# EasyEDA Pro project ProPrj_FurModularity 2_2025-12-27.epro, board PCB2_5
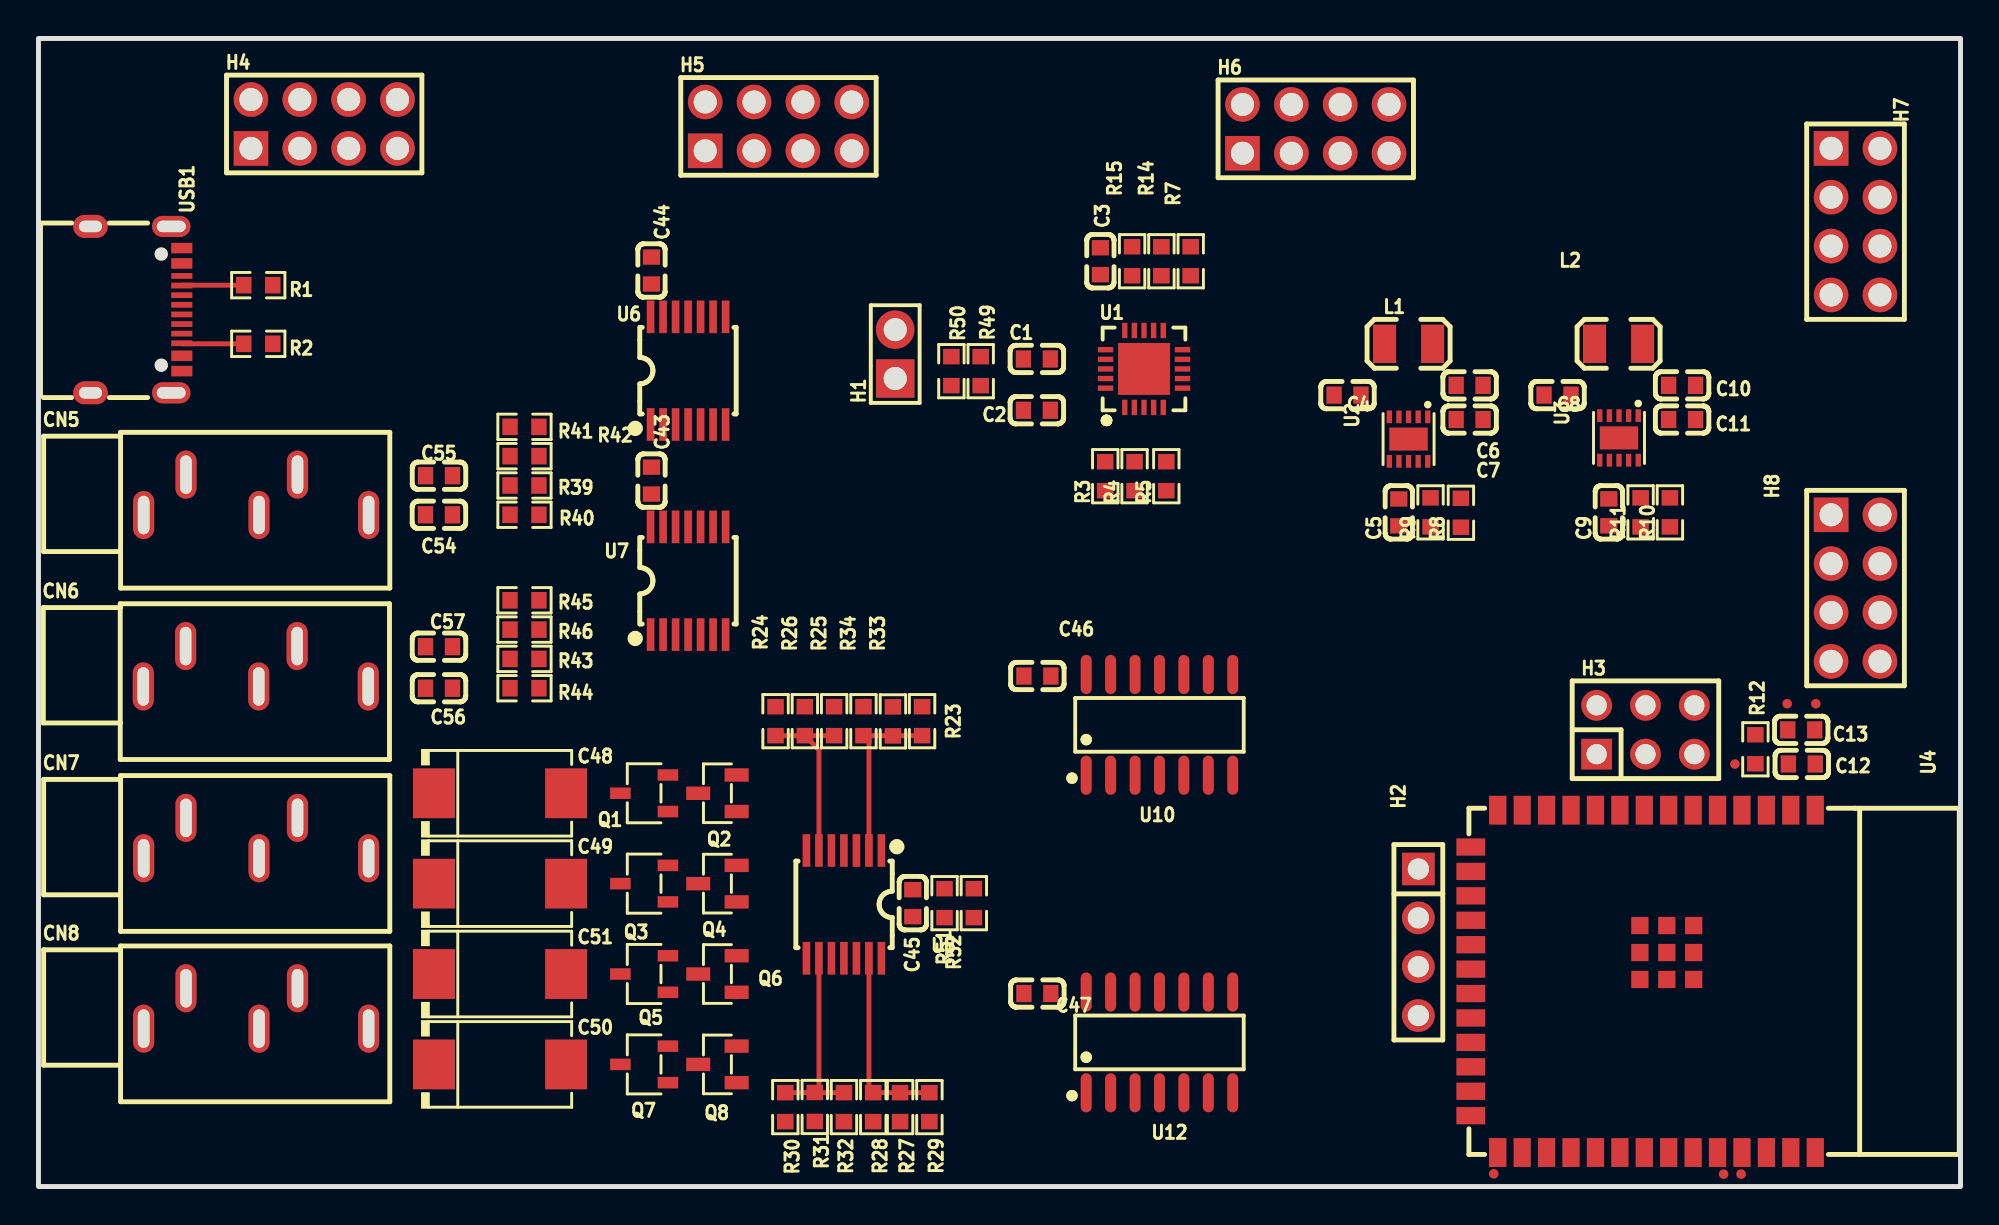
[diagram p9: board, top side]
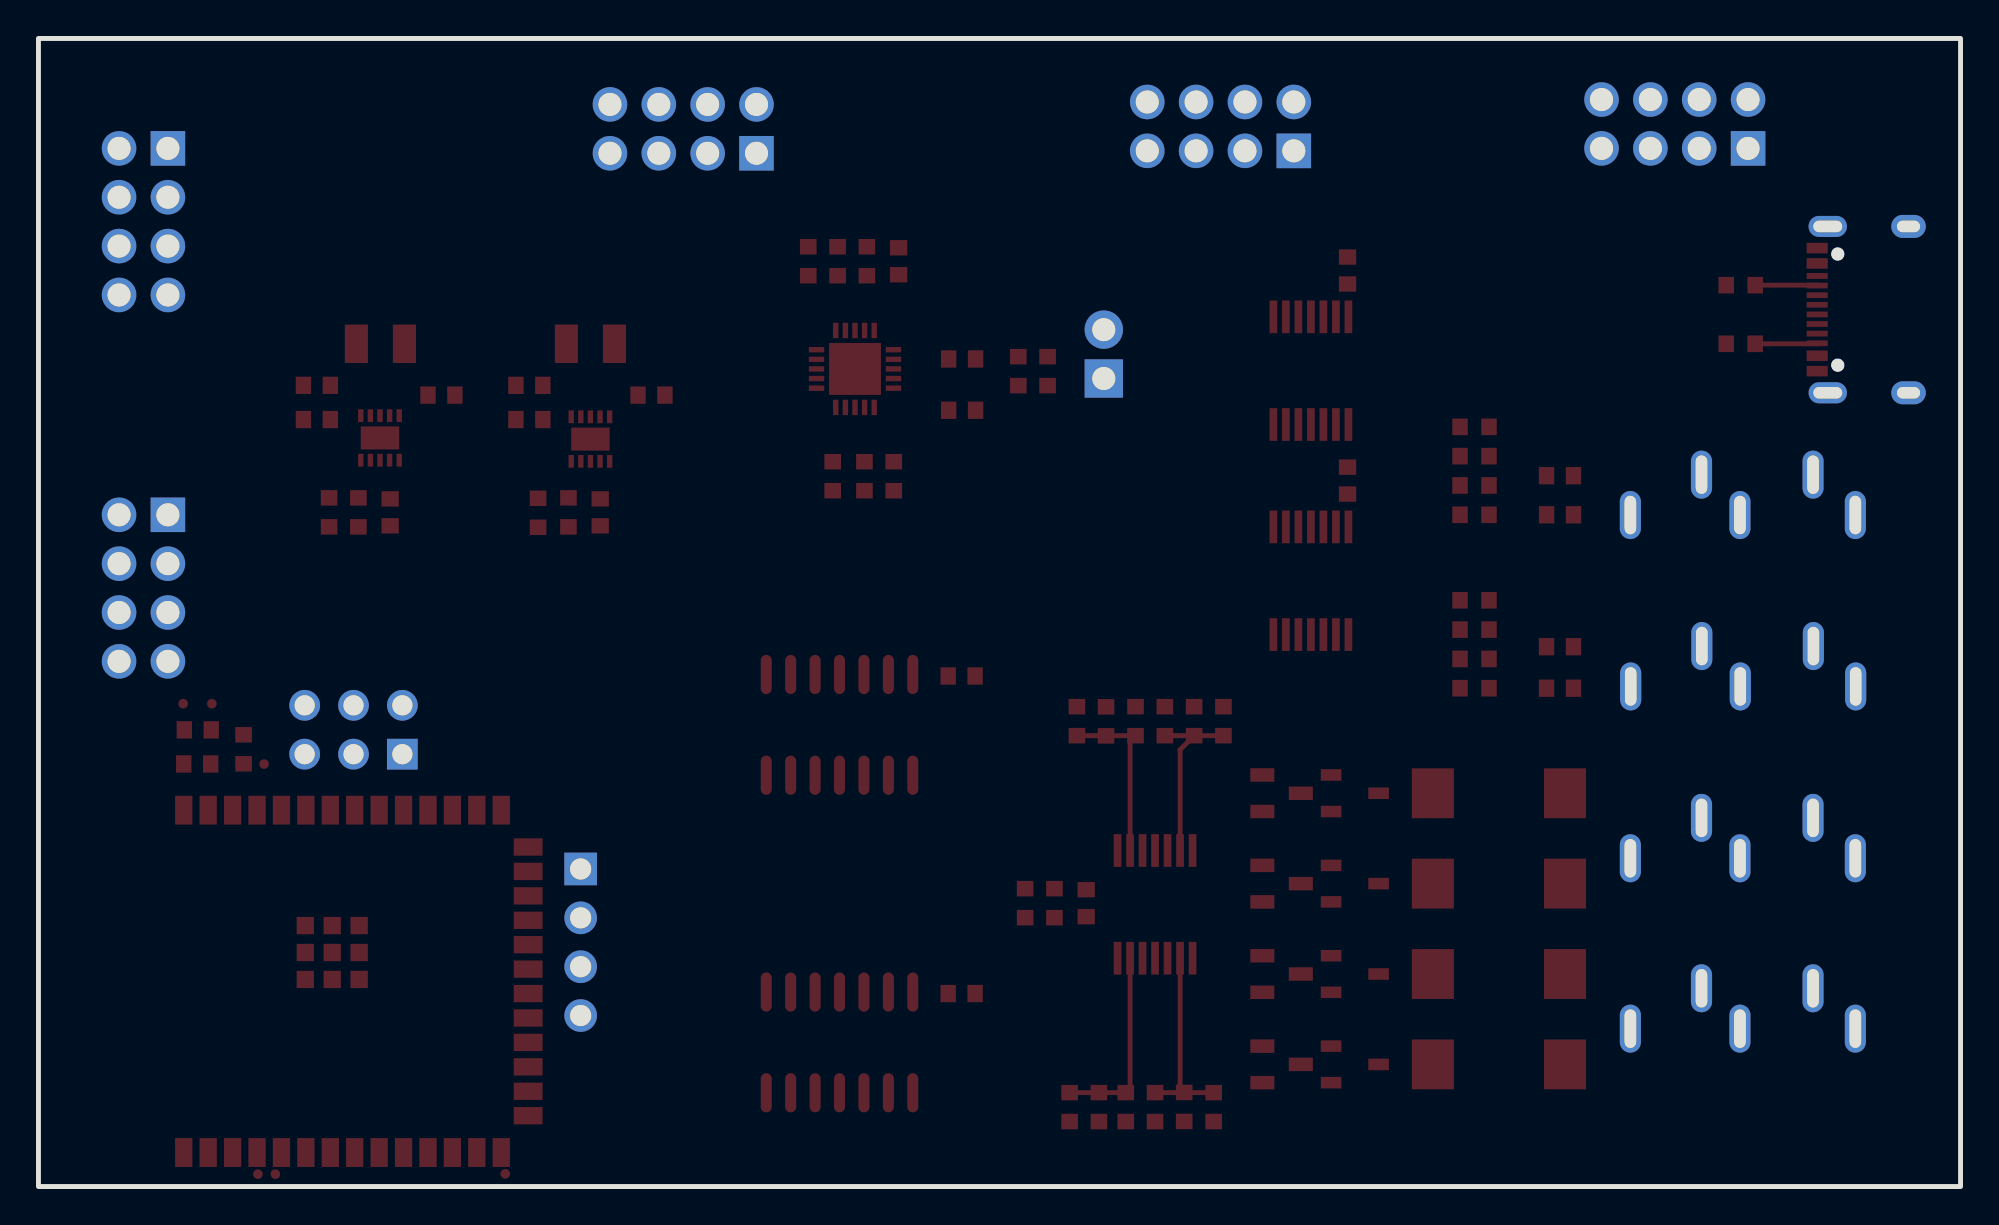
[diagram p10: board, bottom side, seen from below]

Outline 99.95 x 59.69 mm; copper layers: Top Layer, Inner1, Inner2, Bottom Layer. Coordinates in mm from the lower left corner of the outline.
Outline path: rectangle 0,59.69 99.95,0
Stack: Top Layer 0.035mm Outer layer thickness 1oz / Dielectric1 0.2104mm 7628 RC49% 8.6mil / Inner1 0.0152mm Inner layer thickness / Dielectric2 1.065mm 1.1mm H/HOZ Copper / Inner2 0.0152mm Inner layer thickness / Dielectric3 0.2104mm 7628 RC49% 8.6mil / Bottom Layer 0.035mm Outer layer thickness 1oz

## Design rules (mm)
template: JLCPCB Capability(Two Layers Board)
spacing copperThickness1oz (default): track to track 0.102, other pairs 0.152 to 0.3
spacing copperThickness2oz: track to track 0.203, other pairs 0.152 to 0.3
track width copperThickness1oz (default): min 0.127, default 0.254, max 2.54
track width copperThickness2oz: min 0.203, default 0.254, max 2.54
differential pair differentialPair (default): width min 0.127, default 0.254, max 2.54; gap min 0.152, default 0.152
via viaSize (default): diameter min 0.5, default 0.61, max 10; hole min 0.3, default 0.305, max 6.3

## Placement (name value [footprint] x y rotation side)
C1  10uF  [C0603]  51.92 43.03 0 top
C2  4.7uF  [C0603]  51.92 40.36 180 top
C3  4.7uF  [C0603]  55.22 48.11 90 top
C4  10uF  [C0603]  68.07 41.15 180 top
C5  100nF  [C0603]  70.74 35.05 270 top
C6  10uF  [C0603]  74.42 41.66 0 top
C7  10uF  [C0603]  74.42 39.88 0 top
C8  10uF  [C0603]  78.99 41.15 180 top
C9  100nF  [C0603]  81.66 35.05 270 top
C10  10uF  [C0603]  85.47 41.66 0 top
C11  10uF  [C0603]  85.47 39.88 0 top
C12  100nF  [C0603]  91.69 21.97 0 top
C13  100nF  [C0603]  91.66 23.74 0 top
C43  100nF  [C0603]  31.88 36.7 270 top
C44  100nF  [C0603]  31.88 47.62 270 top
C45  100nF  [C0603]  45.47 14.73 90 top
C46  10uF  [C0603]  51.94 26.54 180 top
C47  10uF  [C0603]  51.94 10.03 180 top
C48  470uF  [CAP-SMD_L7.3-W4.3-FD]  24 20.45 0 top
C49  470uF  [CAP-SMD_L7.3-W4.3-FD]  24 15.75 0 top
C50  470uF  [CAP-SMD_L7.3-W4.3-FD]  24 6.35 0 top
C51  470uF  [CAP-SMD_L7.3-W4.3-FD]  24 11.05 0 top
C54  10uF  [C0603]  20.83 34.93 180 top
C55  10uF  [C0603]  20.83 36.96 180 top
C56  10uF  [C0603]  20.83 25.91 180 top
C57  10uF  [C0603]  20.83 28.07 180 top
CN5  KH-PJ-325C  [AUDIO-TH_KH-PJ-325C]  11.32 35.96 0 top
CN6  KH-PJ-325C  [AUDIO-TH_KH-PJ-325C]  11.3 27.05 0 top
CN7  KH-PJ-325C  [AUDIO-TH_KH-PJ-325C]  11.32 18.12 0 top
CN8  KH-PJ-325C  [AUDIO-TH_KH-PJ-325C]  11.32 9.26 0 top
H1  PZ254V-11-02P  [HDR-TH_2P-P2.54-V-M]  44.55 43.28 90 top
H2  PZ254V-11-04P  [HDR-TH_4P-P2.54-V-M]  71.75 12.7 270 top
H3  2.54-2*3  [HDR-TH_6P-P2.54-V-R2-C3-S2.54_A2541WV-2X3P]  83.57 23.75 0 top
H4  A2541WV-2x4P  [HDR-TH_8P-P2.54-V-R2-C4-S2.54_A2541WV-2X4P]  14.86 55.25 0 top
H5  A2541WV-2x4P  [HDR-TH_8P-P2.54-V-R2-C4-S2.54_A2541WV-2X4P]  38.48 55.12 0 top
H6  A2541WV-2x4P  [HDR-TH_8P-P2.54-V-R2-C4-S2.54_A2541WV-2X4P]  66.42 54.99 0 top
H7  A2541WV-2x4P  [HDR-TH_8P-P2.54-V-R2-C4-S2.54_A2541WV-2X4P]  94.49 50.17 270 top
H8  A2541WV-2x4P  [HDR-TH_8P-P2.54-V-R2-C4-S2.54_A2541WV-2X4P]  94.49 31.12 270 top
L1  1.5uH  [L1207]  71.25 43.82 0 top
L2  1.5uH  [L1207]  82.17 43.81 0 top
Q1  MMBT2222A  [SOT-23-3_L2.9-W1.6-P1.90-LS2.8-BR]  31.5 20.45 0 top
Q2  MMBT2907A  [SOT-23-3_L2.9-W1.3-P1.90-LS2.4-BR]  35.31 20.45 0 top
Q3  MMBT2222A  [SOT-23-3_L2.9-W1.6-P1.90-LS2.8-BR]  31.5 15.75 0 top
Q4  MMBT2907A  [SOT-23-3_L2.9-W1.3-P1.90-LS2.4-BR]  35.31 15.75 0 top
Q5  MMBT2222A  [SOT-23-3_L2.9-W1.6-P1.90-LS2.8-BR]  31.5 11.05 0 top
Q6  MMBT2907A  [SOT-23-3_L2.9-W1.3-P1.90-LS2.4-BR]  35.31 11.05 0 top
Q7  MMBT2222A  [SOT-23-3_L2.9-W1.6-P1.90-LS2.8-BR]  31.5 6.35 0 top
Q8  MMBT2907A  [SOT-23-3_L2.9-W1.3-P1.90-LS2.4-BR]  35.31 6.35 0 top
R1  5.1kΩ  [R0603]  11.43 46.86 180 top
R2  5.1kΩ  [R0603]  11.43 43.82 180 top
R3  330kΩ  [R0603]  55.47 36.93 270 top
R4  110kΩ  [R0603]  57 36.93 90 top
R5  10kΩ  [R0603]  58.65 36.93 90 top
R7  100kΩ  [R0603]  59.92 48.11 270 top
R8  1.13MΩ  [R0603]  73.97 35.03 270 top
R9  200kΩ  [R0603]  72.39 35.05 90 top
R10  1.8MΩ  [R0603]  84.84 35.05 270 top
R11  200kΩ  [R0603]  83.31 35.05 90 top
R12  10kΩ  [R0603]  89.28 22.73 90 top
R14  1kΩ  [R0603]  58.39 48.11 270 top
R15  1kΩ  [R0603]  56.87 48.11 270 top
R23  1kΩ  [R0603]  45.95 24.19 90 top
R24  1kΩ  [R0603]  38.33 24.19 90 top
R25  1kΩ  [R0603]  41.38 24.19 270 top
R26  1kΩ  [R0603]  39.85 24.19 270 top
R27  1kΩ  [R0603]  44.81 4.13 90 top
R28  1kΩ  [R0603]  43.41 4.13 90 top
R29  1kΩ  [R0603]  46.33 4.13 270 top
R30  1kΩ  [R0603]  38.84 4.13 270 top
R31  1kΩ  [R0603]  40.37 4.14 90 top
R32  1kΩ  [R0603]  41.88 4.13 90 top
R33  1kΩ  [R0603]  44.43 24.19 270 top
R34  1kΩ  [R0603]  42.9 24.19 270 top
R39  10kΩ  [R0603]  25.27 36.45 0 top
R40  10kΩ  [R0603]  25.27 34.93 180 top
R41  10kΩ  [R0603]  25.27 39.5 0 top
R42  10kΩ  [R0603]  25.27 37.97 180 top
R43  10kΩ  [R0603]  25.27 27.43 0 top
R44  10kΩ  [R0603]  25.27 25.91 180 top
R45  10kΩ  [R0603]  25.27 30.48 0 top
R46  10kΩ  [R0603]  25.27 28.96 180 top
R49  1kΩ  [R0603]  49 42.39 90 top
R50  1kΩ  [R0603]  47.47 42.39 270 top
R51  1kΩ  [R0603]  47.12 14.73 90 top
R52  1kΩ  [R0603]  48.64 14.73 270 top
TP1  -  [Test-Point-0.5mm]  88.22 21.97 0 top
TP2  -  [Test-Point-0.5mm]  75.68 0.66 0 top
TP3  -  [Test-Point-0.5mm]  88.54 0.65 0 top
TP4  -  [Test-Point-0.5mm]  87.63 0.65 0 top
TP5  -  [Test-Point-0.5mm]  90.93 25.1 0 top
TP6  -  [Test-Point-0.5mm]  92.43 25.1 0 top
U1  MCP73871-2CAI/ML  [QFN-20_L4.0-W4.0-P0.50-BL-EP2.7]  57.49 42.51 0 top
U2  TPS63030DSKTG4  [SON-10_L2.5-W2.5-P0.50-TL-EP]  71.25 38.86 270 top
U3  TPS63030DSKTG4  [SON-10_L2.5-W2.5-P0.50-TL-EP]  82.19 38.92 270 top
U4  ESP32-S3-WROOM-1-N4  [WIFIM-SMD_ESP32-S3-WROOM-1-N8]  83.44 10.67 270 top
U6  MCP4261-103E/ST  [TSSOP-14_L5.0-W4.4-P0.65-LS6.4-BL]  33.78 42.42 0 top
U7  MCP4261-103E/ST  [TSSOP-14_L5.0-W4.4-P0.65-LS6.4-BL]  33.78 31.5 0 top
U8  LMV324IPWRE4  [TSSOP-14_L5.0-W4.4-P0.65-LS6.4-BL]  41.88 14.67 180 top
U10  74VHC4066M  [SOIC-14_L8.7-W3.9-P1.27-LS6.0-BL]  58.29 24 0 top
U12  74VHC4066M  [SOIC-14_L8.7-W3.9-P1.27-LS6.0-BL]  58.29 7.49 0 top
USB1  TYPE-C 16PIN 2MD(073)  [USB-C-SMD_TYPE-C-6PIN-2MD-073]  5.08 45.59 270 top

## Footprints (pads in the part's own frame, mm; a bottom-side part is the same pattern mirrored in y, then rotated)
AUDIO-TH_KH-PJ-325C
  oval 1.1x2.5 hole 0.6x2: 1(-5.85,-1.05) 2(0.15,-1.05) 3(2.15,1.05) 4(5.85,-1.05) 5(-3.65,1.05)
C0603
  rect 0.8x0.9 smd: 1(-0.7,0) 2(0.7,0)
CAP-SMD_L7.3-W4.3-FD
  rect 2.185x2.592 smd: 1(-3.437,0) 2(3.437,0)
HDR-TH_2P-P2.54-V-M
  rect 2x2 hole 1.2: 1(-1.27,0)
  round 2 hole 1.2: 2(1.27,0)
HDR-TH_4P-P2.54-V-M
  rect 1.7x1.7 hole 1.1: 1(-3.81,0)
  round 1.7 hole 1.1: 2(-1.27,0) 3(1.27,0) 4(3.81,0)
HDR-TH_6P-P2.54-V-R2-C3-S2.54_A2541WV-2X3P
  rect 1.6x1.6 hole 1.05: 1(-2.54,-1.27)
  round 1.6 hole 1.05: 2(-2.54,1.27) 3(0,-1.27) 4(0,1.27) 5(2.54,-1.27) 6(2.54,1.27)
HDR-TH_8P-P2.54-V-R2-C4-S2.54_A2541WV-2X4P
  rect 1.8x1.8 hole 1.2: 1(-3.81,-1.27)
  round 1.8 hole 1.2: 2(-3.81,1.27) 3(-1.27,-1.27) 4(-1.27,1.27) 5(1.27,-1.27) 6(1.27,1.27) 7(3.81,-1.27) 8(3.81,1.27)
L1207
  rect 1.2x2 smd: 1(-1.25,0) 2(1.25,0)
QFN-20_L4.0-W4.0-P0.50-BL-EP2.7
  rect 0.28x0.8 smd: 1(-1,-2) 2(-0.5,-2) 3(0,-2) 4(0.5,-2) 5(1,-2) 11(1,2) 12(0.5,2) 13(0,2) 14(-0.5,2) 15(-1,2)
  rect 0.8x0.28 smd: 6(2,-1) 7(2,-0.5) 8(2,0) 9(2,0.5) 10(2,1) 16(-2,1) 17(-2,0.5) 18(-2,0) 19(-2,-0.5) 20(-2,-1)
  rect 2.7x2.7 smd: 21(0,0)
R0603
  rect 0.806x0.864 smd: 1(-0.753,0) 2(0.753,0)
SOIC-14_L8.7-W3.9-P1.27-LS6.0-BL
  oval 0.574x2.038 smd: 1(-3.81,-2.619) 2(-2.54,-2.619) 3(-1.27,-2.619) 4(0,-2.619) 5(1.27,-2.619) 6(2.54,-2.619) 7(3.81,-2.619) 8(3.81,2.619) 9(2.54,2.619) 10(1.27,2.619) 11(0,2.619) 12(-1.27,2.619) 13(-2.54,2.619) 14(-3.81,2.619)
SON-10_L2.5-W2.5-P0.50-TL-EP
  rect 0.665x0.28 smd: 1(-1.157,1) 2(-1.157,0.5) 3(-1.157,0) 4(-1.157,-0.5) 5(-1.157,-1) 6(1.157,-1) 7(1.157,-0.5) 8(1.157,0) 9(1.157,0.5) 10(1.157,1)
  rect 1.2x2 smd: 11(0,0)
SOT-23-3_L2.9-W1.3-P1.90-LS2.4-BR
  rect 1.25x0.7 smd: 1(1,-0.95) 2(1,0.95) 3(-1,0)
SOT-23-3_L2.9-W1.6-P1.90-LS2.8-BR
  rect 1.07x0.6 smd: 1(1.235,-0.95) 2(1.235,0.95) 3(-1.235,0)
Test-Point-0.5mm
  round 0.5 smd: 1(0,0)
TSSOP-14_L5.0-W4.4-P0.65-LS6.4-BL
  rect 0.4x1.7 smd: 1(-1.95,-2.8) 2(-1.3,-2.8) 3(-0.65,-2.8) 4(0,-2.8) 5(0.65,-2.8) 6(1.3,-2.8) 7(1.95,-2.8) 8(1.95,2.8) 9(1.3,2.8) 10(0.65,2.8) 11(0,2.8) 12(-0.65,2.8) 13(-1.3,2.8) 14(-1.95,2.8)
USB-C-SMD_TYPE-C-6PIN-2MD-073
  rect 0.55x1.1 smd: 1(-3.2,2.375) 2(-2.4,2.375) 11(2.4,2.375) 12(3.2,2.375)
  rect 0.3x1.1 smd: 3(-1.75,2.375) 4(-1.25,2.375) 5(-0.75,2.375) 6(-0.25,2.375) 7(0.25,2.375) 8(0.75,2.375) 9(1.25,2.375) 10(1.75,2.375)
  oval 1.1x2 hole 0.6x1.5: 13(-4.325,1.825) 14(4.325,1.825)
  oval 1.2x1.8 hole 0.6x1.2: 13(-4.325,-2.375) 14(4.325,-2.375)
WIFIM-SMD_ESP32-S3-WROOM-1-N8
  rect 1.5x0.9 smd: 1(-8.9,8.954) 2(-8.9,7.684) 3(-8.9,6.415) 4(-8.9,5.144) 5(-8.9,3.874) 6(-8.9,2.604) 7(-8.9,1.335) 8(-8.9,0.065) 9(-8.9,-1.206) 10(-8.9,-2.475) 11(-8.9,-3.745) 12(-8.9,-5.016) 13(-8.9,-6.285) 14(-8.9,-7.556) 27(8.9,-7.556) 28(8.9,-6.285) 29(8.9,-5.016) 30(8.9,-3.745) 31(8.9,-2.475) 32(8.9,-1.206) 33(8.9,0.065) 34(8.9,1.335) 35(8.9,2.604) 36(8.9,3.874) 37(8.9,5.144) 38(8.9,6.415) 39(8.9,7.684) 40(8.9,8.954)
  rect 0.9x1.5 smd: 15(-6.985,-8.954) 16(-5.715,-8.954) 17(-4.445,-8.954) 18(-3.175,-8.954) 19(-1.905,-8.954) 20(-0.635,-8.954) 21(0.635,-8.954) 22(1.905,-8.954) 23(3.175,-8.954) 24(4.445,-8.954) 25(5.715,-8.954) 26(6.985,-8.954)
  rect 0.9x0.9 smd: 41(-2.9,2.635) 41(-2.9,1.235) 41(-2.9,-0.165) 41(-1.5,2.635) 41(-1.5,1.235) 41(-1.5,-0.165) 41(-0.1,2.635) 41(-0.1,1.235) 41(-0.1,-0.165)

## Nets
3V3: C6.1 C7.1 C12.1 C13.1 C43.2 C44.2 C45.2 C46.1 C47.1 H4.8 H5.8 H6.8 H7.8 H8.8 Q1.3 Q3.3 Q5.3 Q7.3 R8.2 R12.2 R39.2 R41.2 R43.2 R45.2 R51.2 TP5.1 U2.1 U4.2 U6.14 U7.14 U8.4 U10.14 U12.14
5V: C10.1 C11.1 H2.2 H4.1 H5.1 H6.1 H7.1 H8.1 R10.2 U3.1
GND: C1.1 C2.2 C3.2 C4.2 C5.2 C6.2 C7.2 C8.2 C9.2 C10.2 C11.2 C12.2 C13.2 C43.1 C44.1 C45.1 C46.2 C47.2 CN5.1 CN6.1 CN7.1 CN8.1 H1.2 H2.1 H3.1 H4.2 H4.7 H5.2 H5.7 H6.2 H6.7 H7.2 H7.7 H8.2 H8.7 Q2.2 Q4.2 Q6.2 Q8.2 R1.1 R2.1 R4.1 R5.1 R7.1 R9.1 R11.1 R14.1 R40.1 R42.1 R44.1 R46.1 R50.1 R52.1 TP6.1 U1.3 U1.10 U1.11 U1.21 U2.3 U2.9 U2.11 U3.3 U3.9 U3.11 U4.1 U4.40 U4.41 U6.4 U6.7 U6.8 U6.12 U7.4 U7.7 U7.8 U7.12 U8.11 U10.7 U12.7 USB1.1 USB1.12
VBAT: C3.1 H1.1 R49.2 U1.14 U1.15 U1.16
VBAT_SENSE: R49.1 R50.2 U4.39
VBUS: C1.2 R3.2 U1.18 U1.19 USB1.2 USB1.11
CLK: H4.6 H5.6 H6.6 H7.6 H8.6
CS1: H4.5 U4.29
CS2: H5.5 U4.30
CS3: H6.5 U4.31
CS4: H7.5 U4.32
CS5: H8.5 U4.33
CTRL_IN1_OUT1: U4.10 U10.5 U10.13
CTRL_IN1_OUT2: U4.11 U12.5 U12.13
CTRL_IN2_OUT1: U4.13 U10.6 U10.12
CTRL_IN2_OUT2: U4.28 U12.6 U12.12
DOWN: H3.4 U4.5
ENTER: H3.6 U4.15
IJACK1_L: C55.2 CN5.5
IJACK1_R: C54.2 CN5.2
IJACK2_L: C57.2 CN6.5
IJACK2_R: C56.2 CN6.2
IN1_L: C55.1 R41.1 R42.2 U6.10
IN1_L_SW1: R33.1 U10.3
IN1_L_SW2: R32.1 U12.3
IN1_POTOUT_L: U6.9 U10.4 U12.4
IN1_POTOUT_R: U6.6 U10.1 U12.1
IN1_R: C54.1 R39.1 R40.2 U6.5
IN1_R_SW1: R25.1 U10.2
IN1_R_SW2: R28.1 U12.2
IN2_L: C57.1 R45.1 R46.2 U7.10
IN2_L_SW1: R34.1 U10.9
IN2_L_SW2: R31.1 U12.9
IN2_POTOUT_L: U7.9 U10.8 U12.8
IN2_POTOUT_R: U7.6 U10.11 U12.11
IN2_R: C56.1 R43.1 R44.2 U7.5
IN2_R_SW1: R26.1 U10.10
IN2_R_SW2: R27.1 U12.10
LEFT: H3.2 U4.7
MISO: H4.4 H5.4 H6.4 H7.4 H8.4 U4.20 U6.13 U7.13
MOSI: H4.3 H5.3 H6.3 H7.3 H8.3 U4.21 U6.3 U7.3
OJACK1_L: C48.1 CN7.5
OJACK1_R: C49.1 CN7.2
OJACK2_L: C51.1 CN8.5
OJACK2_R: C50.1 CN8.2
OUT1_L: C48.2 Q1.2 Q2.3 R23.2
OUT1_R: C49.2 Q3.2 Q4.3 R24.2
OUT2_L: C51.2 Q5.2 Q6.3 R30.2
OUT2_R: C50.2 Q7.2 Q8.3 R29.2
P1_CS: U4.8 U6.1
P2_CS: U4.9 U7.1
REF_1V65: R51.1 R52.2 U8.3 U8.5 U8.10 U8.12
RIGHT: H3.3 U4.6
SCK: U4.22 U6.2 U7.2
SCL: H2.4 U4.17
SDA: H2.3 U4.12
UP: H3.5 U4.4
USB_DM: U4.14 USB1.5 USB1.7
USB_DP: U4.23 USB1.6 USB1.8
USB_SENSE: U1.6 U4.38
VSYS: C2.1 C4.1 C8.1 U1.1 U1.4 U1.9 U1.17 U1.20 U2.5 U3.5
$1N480: R1.2 USB1.4
$1N506: R2.2 USB1.10
$1N1632: R3.1 R4.2 U1.2
$1N1764: R5.2 U1.5
$1N1839: R15.2 U1.13
$1N1881: R7.2 U1.12
$1N2370: C5.1 U2.6 U2.7 U2.8
$1N2432: L1.2 U2.2
$1N2438: L1.1 U2.4
$1N2461: R8.1 R9.2 U2.10
$1N3033: R10.1 R11.2 U3.10
$1N3038: L2.2 U3.2
$1N3051: C9.1 U3.6 U3.7 U3.8
$1N3063: L2.1 U3.4
$1N4175: R14.2 R15.1
$2N491: TP2.1 U4.27
$2N495: R12.1 TP1.1 U4.3
$2N518: TP3.1 U4.37
$2N539: TP4.1 U4.36
$3N1138: R23.1 R33.2 R34.2 U8.2
$3N1139: R24.1 R25.2 R26.2 U8.6
$3N1144: R27.2 R28.2 R29.1 U8.13
$3N1145: R30.1 R31.2 R32.2 U8.9
$3N1256: Q5.1 Q6.1 U8.8
$3N2308: Q1.1 Q2.1 U8.1
$3N2351: Q3.1 Q4.1 U8.7
$3N2603: Q7.1 Q8.1 U8.14

Pads without a net: CN5 3 4; CN6 3 4; CN7 3 4; CN8 3 4; U1 7 8; U4 16 18 19 24 25 26 34 35; U6 11; U7 11; USB1 3 9 13 14

## Routing (per net, layer and track width the routed paths; a pad name or vN(x,y) marks a point on that pad's centre or on a via; arc(x,y) is an arc through that point)
$1N480: length 3.2
  Top Layer w0.254: USB1.4 7.47,46.86 R1.2
$1N506: length 3.2
  Top Layer w0.254: R2.2 7.48,43.82 USB1.10
$3N1138: length 9.1
  Top Layer w0.254: U8.2 43.19,23.16 R34.2 R23.1
$3N1139: length 9.3
  Top Layer w0.254: R24.1 R26.2 ; R26.2 R25.2 ; R26.2 40.59,22.71 U8.6
$3N1144: length 10
  Top Layer w0.254: 46.33,4.88 43.41,4.88 43.19,5.11 U8.13
$3N1145: length 10.1
  Top Layer w0.254: R31.2 40.59,5.11 U8.9 ; 38.84,4.88 41.88,4.88
